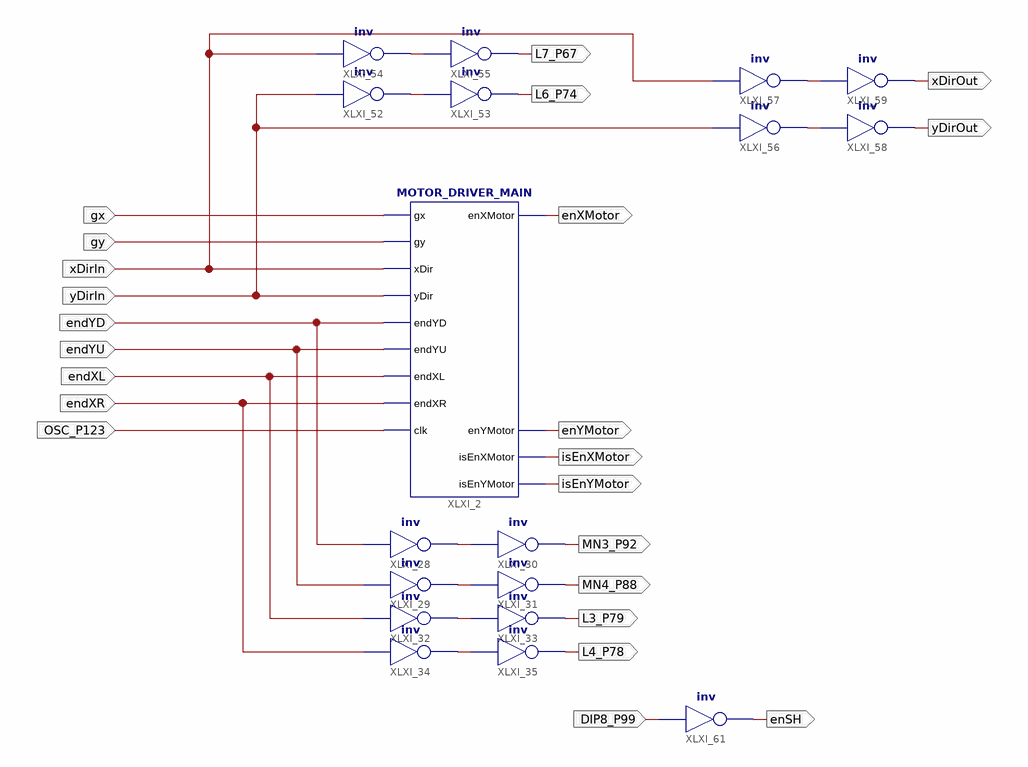
[diagram p0: schematic sheet 1]
// Xilinx ISE schematic main_motor.sch (spartan6) as structural Verilog: 18 symbols, 23 ports
module main_motor (
  input  gx,
  input  gy,
  input  xDirIn,
  input  yDirIn,
  input  endYD,
  input  endYU,
  input  endXL,
  input  endXR,
  input  OSC_P123,
  input  DIP8_P99,
  output enXMotor,
  output enYMotor,
  output isEnXMotor,
  output isEnYMotor,
  output MN3_P92,
  output MN4_P88,
  output L3_P79,
  output L4_P78,
  output L6_P74,
  output L7_P67,
  output yDirOut,
  output xDirOut,
  output enSH
);

  wire XLXN_50, XLXN_51, XLXN_52, XLXN_53, XLXN_74, XLXN_75, XLXN_80, XLXN_81;

  MOTOR_DRIVER_MAIN XLXI_2 (
    .gx(gx), .gy(gy), .xDir(xDirIn), .yDir(yDirIn), .endYD(endYD), .endYU(endYU), .endXL(endXL),
    .endXR(endXR), .clk(OSC_P123), .enXMotor(enXMotor), .enYMotor(enYMotor), .isEnXMotor(isEnXMotor),
    .isEnYMotor(isEnYMotor));
  not XLXI_28 (XLXN_50, endYD);
  not XLXI_29 (XLXN_51, endYU);
  not XLXI_30 (MN3_P92, XLXN_50);
  not XLXI_31 (MN4_P88, XLXN_51);
  not XLXI_32 (XLXN_52, endXL);
  not XLXI_33 (L3_P79, XLXN_52);
  not XLXI_34 (XLXN_53, endXR);
  not XLXI_35 (L4_P78, XLXN_53);
  not XLXI_52 (XLXN_74, yDirIn);
  not XLXI_53 (L6_P74, XLXN_74);
  not XLXI_54 (XLXN_75, xDirIn);
  not XLXI_55 (L7_P67, XLXN_75);
  not XLXI_56 (XLXN_80, yDirIn);
  not XLXI_57 (XLXN_81, xDirIn);
  not XLXI_58 (yDirOut, XLXN_80);
  not XLXI_59 (xDirOut, XLXN_81);
  not XLXI_61 (enSH, DIP8_P99);
endmodule
